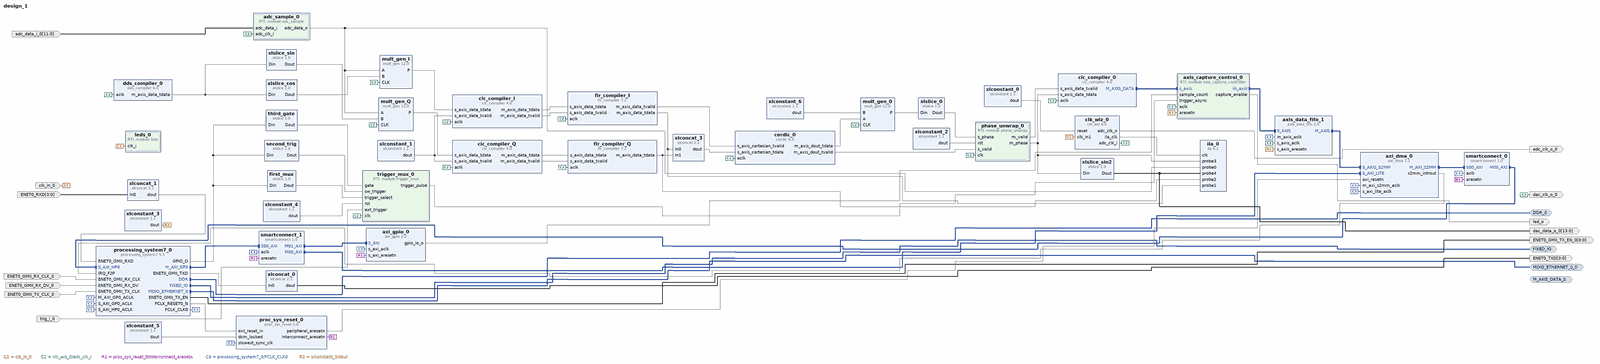
[diagram p0: block diagram of the top level, whole]
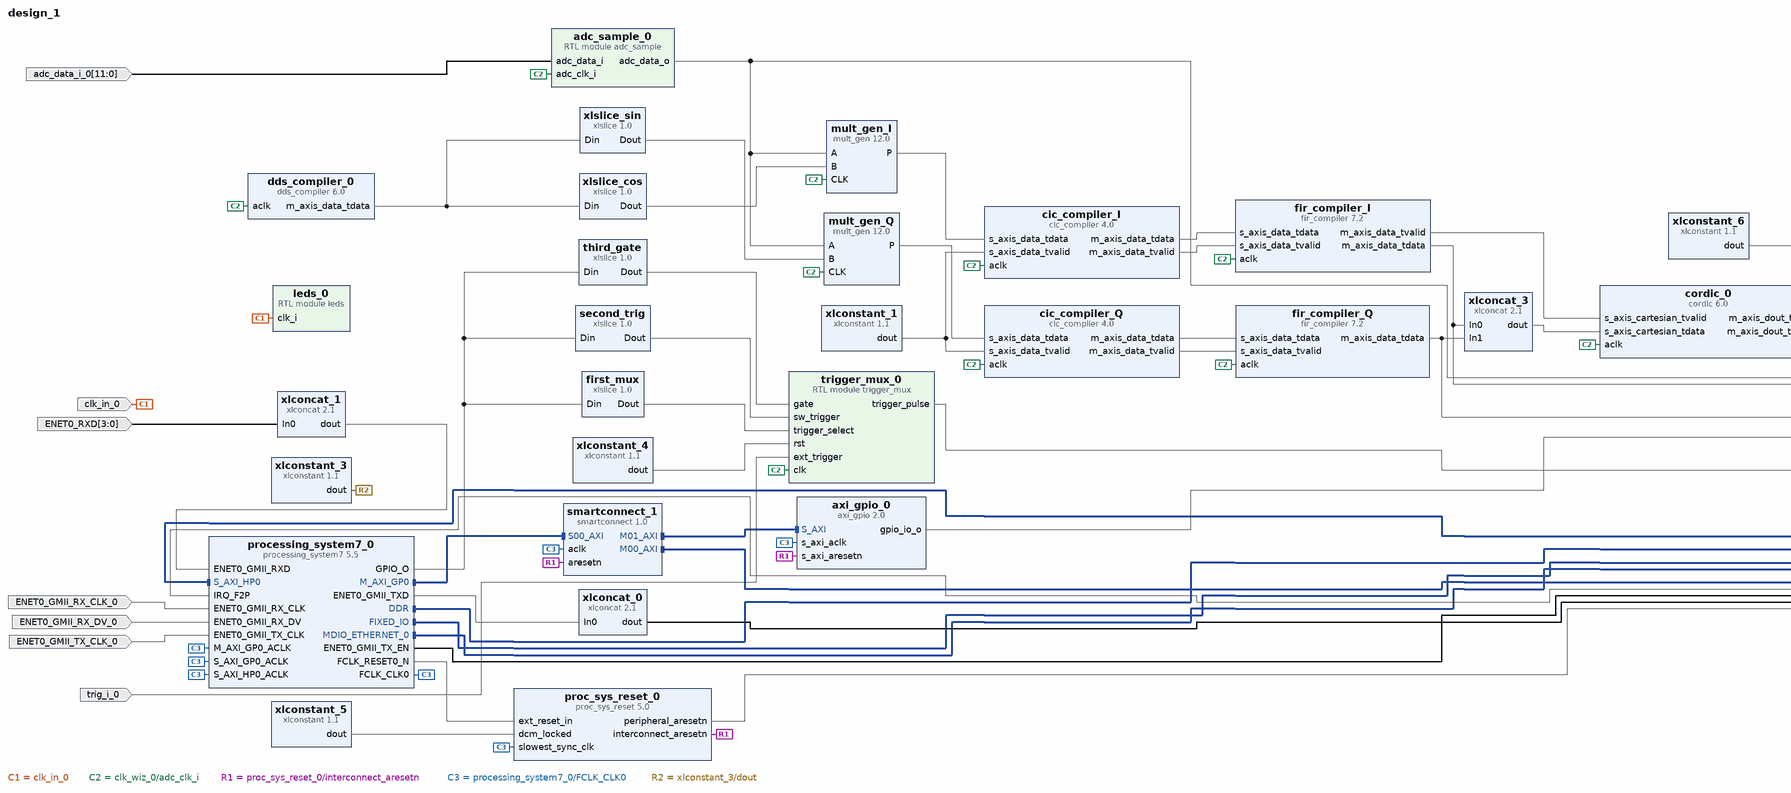
[diagram p1: block diagram of the top level, left part]
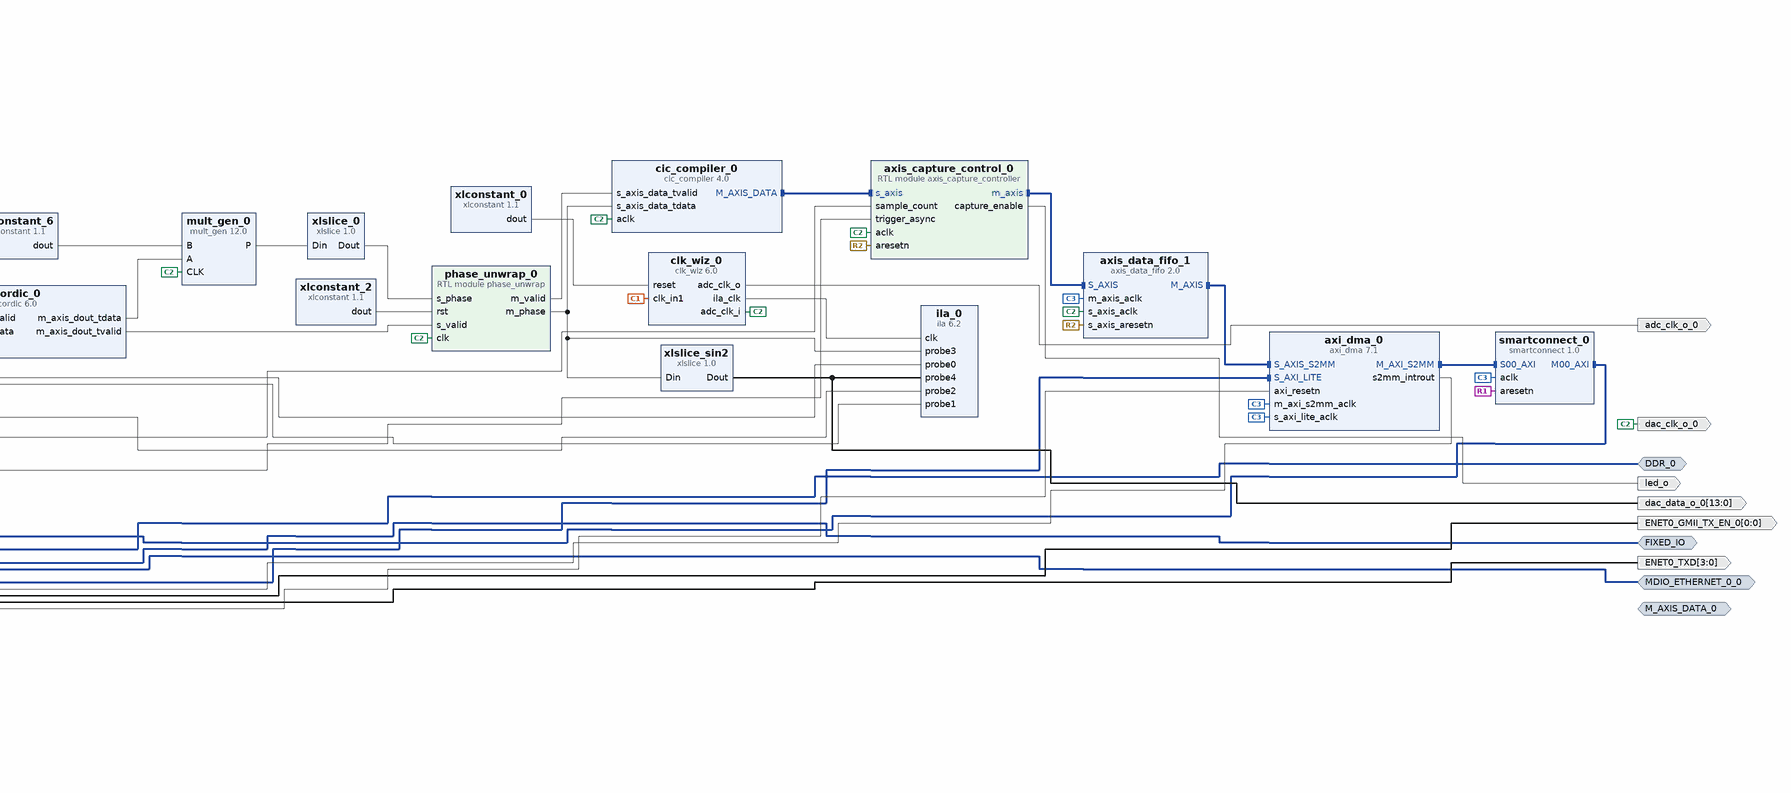
[diagram p2: block diagram of the top level, right part]
# Vivado block design design_1, xc7z010clg400-1, Vivado 2024.2
create_bd_design design_1

create_bd_intf_port -mode Master -vlnv xilinx.com:display_processing_system7:fixedio_rtl:1.0 FIXED_IO
create_bd_intf_port -mode Master -vlnv xilinx.com:interface:ddrx_rtl:1.0 DDR_0
create_bd_intf_port -mode Master -vlnv xilinx.com:interface:mdio_rtl:1.0 MDIO_ETHERNET_0_0
create_bd_intf_port -mode Master -vlnv xilinx.com:interface:axis_rtl:1.0 M_AXIS_DATA_0
set_property -dict {CONFIG.FREQ_HZ 50000000} [get_bd_intf_ports M_AXIS_DATA_0]
create_bd_port -dir O -from 3 -to 0 ENET0_TXD
create_bd_port -dir I -from 3 -to 0 ENET0_RXD
create_bd_port -dir I -type clk ENET0_GMII_RX_CLK_0
create_bd_port -dir I -type clk ENET0_GMII_TX_CLK_0
create_bd_port -dir I ENET0_GMII_RX_DV_0
create_bd_port -dir O -from 0 -to 0 ENET0_GMII_TX_EN_0
create_bd_port -dir O led_o
create_bd_port -dir I -from 11 -to 0 adc_data_i_0
create_bd_port -dir I clk_in_0
create_bd_port -dir O adc_clk_o_0
create_bd_port -dir O -type clk dac_clk_o_0
create_bd_port -dir O -from 13 -to 0 dac_data_o_0
create_bd_port -dir I trig_i_0

create_bd_cell -type ip -vlnv xilinx.com:ip:processing_system7:5.5 processing_system7_0
set_property -dict [list \
  CONFIG.PCW_ENET0_ENET0_IO EMIO \
  CONFIG.PCW_ENET0_GRP_MDIO_ENABLE 1 \
  CONFIG.PCW_ENET0_GRP_MDIO_IO EMIO \
  CONFIG.PCW_ENET0_PERIPHERAL_ENABLE 1 \
  CONFIG.PCW_ENET0_PERIPHERAL_FREQMHZ {100 Mbps} \
  CONFIG.PCW_ENET0_RESET_ENABLE 0 \
  CONFIG.PCW_ENET_RESET_ENABLE 1 \
  CONFIG.PCW_ENET_RESET_SELECT {Share reset pin} \
  CONFIG.PCW_FCLK_CLK0_BUF FALSE \
  CONFIG.PCW_FPGA0_PERIPHERAL_FREQMHZ 100 \
  CONFIG.PCW_FPGA1_PERIPHERAL_FREQMHZ 10 \
  CONFIG.PCW_GPIO_EMIO_GPIO_ENABLE 1 \
  CONFIG.PCW_GPIO_EMIO_GPIO_IO 4 \
  CONFIG.PCW_GPIO_EMIO_GPIO_WIDTH 4 \
  CONFIG.PCW_GPIO_MIO_GPIO_ENABLE 1 \
  CONFIG.PCW_GPIO_MIO_GPIO_IO MIO \
  CONFIG.PCW_I2C_RESET_ENABLE 1 \
  CONFIG.PCW_IRQ_F2P_INTR 1 \
  CONFIG.PCW_SD0_GRP_CD_ENABLE 1 \
  CONFIG.PCW_SD0_GRP_CD_IO {MIO 47} \
  CONFIG.PCW_SD0_GRP_WP_ENABLE 0 \
  CONFIG.PCW_SD0_PERIPHERAL_ENABLE 1 \
  CONFIG.PCW_SD0_SD0_IO {MIO 40 .. 45} \
  CONFIG.PCW_SDIO_PERIPHERAL_FREQMHZ 10 \
  CONFIG.PCW_S_AXI_HP0_DATA_WIDTH 32 \
  CONFIG.PCW_UART0_PERIPHERAL_ENABLE 1 \
  CONFIG.PCW_UART0_UART0_IO {MIO 14 .. 15} \
  CONFIG.PCW_UART1_PERIPHERAL_ENABLE 0 \
  CONFIG.PCW_UART_PERIPHERAL_FREQMHZ 100 \
  CONFIG.PCW_UIPARAM_DDR_BUS_WIDTH {16 Bit} \
  CONFIG.PCW_UIPARAM_DDR_FREQ_MHZ 533.333 \
  CONFIG.PCW_UIPARAM_DDR_PARTNO {MT41K256M16 RE-125} \
  CONFIG.PCW_USB0_PERIPHERAL_ENABLE 1 \
  CONFIG.PCW_USB0_RESET_ENABLE 0 \
  CONFIG.PCW_USB0_USB0_IO {MIO 28 .. 39} \
  CONFIG.PCW_USB_RESET_ENABLE 1 \
  CONFIG.PCW_USB_RESET_SELECT {Share reset pin} \
  CONFIG.PCW_USE_FABRIC_INTERRUPT 1 \
  CONFIG.PCW_USE_S_AXI_GP0 1 \
  CONFIG.PCW_USE_S_AXI_HP0 1 \
] [get_bd_cells processing_system7_0]
# 226 more settings of processing_system7_0 are not shown: defaults, MIO pin electricals, DDR timing, and values the tool derives
create_bd_cell -type ip -vlnv xilinx.com:ip:xlconcat:2.1 xlconcat_0
set_property -dict {CONFIG.IN0_WIDTH 4 CONFIG.NUM_PORTS 1 CONFIG.dout_width 4} [get_bd_cells xlconcat_0]
create_bd_cell -type ip -vlnv xilinx.com:ip:xlconcat:2.1 xlconcat_1
set_property -dict {CONFIG.IN0_WIDTH 4 CONFIG.IN1_WIDTH 4 CONFIG.dout_width 8} [get_bd_cells xlconcat_1]
create_bd_cell -type module -reference leds leds_0
create_bd_cell -type module -reference adc_sample adc_sample_0
create_bd_cell -type ip -vlnv xilinx.com:ip:ila:6.2 ila_0
set_property -dict [list \
  CONFIG.C_DATA_DEPTH 16384 \
  CONFIG.C_MONITOR_TYPE Native \
  CONFIG.C_NUM_OF_PROBES 5 \
  CONFIG.C_PROBE0_WIDTH 12 \
  CONFIG.C_PROBE10_WIDTH 1 \
  CONFIG.C_PROBE12_WIDTH 1 \
  CONFIG.C_PROBE1_WIDTH 24 \
  CONFIG.C_PROBE2_WIDTH 24 \
  CONFIG.C_PROBE3_WIDTH 32 \
  CONFIG.C_PROBE4_WIDTH 14 \
  CONFIG.C_PROBE5_WIDTH 1 \
  CONFIG.C_PROBE6_WIDTH 1 \
  CONFIG.C_PROBE7_WIDTH 1 \
  CONFIG.C_PROBE8_WIDTH 1 \
  CONFIG.C_PROBE9_WIDTH 1 \
  CONFIG.C_TRIGIN_EN false \
] [get_bd_cells ila_0]
create_bd_cell -type ip -vlnv xilinx.com:ip:clk_wiz:6.0 clk_wiz_0
set_property -dict [list \
  CONFIG.CLKIN1_JITTER_PS 1000.0 \
  CONFIG.CLKOUT1_JITTER 706.970 \
  CONFIG.CLKOUT1_PHASE_ERROR 883.386 \
  CONFIG.CLKOUT1_REQUESTED_OUT_FREQ 50 \
  CONFIG.CLKOUT2_JITTER 1045.072 \
  CONFIG.CLKOUT2_PHASE_ERROR 883.386 \
  CONFIG.CLKOUT2_REQUESTED_OUT_FREQ 5 \
  CONFIG.CLKOUT2_USED true \
  CONFIG.CLKOUT3_JITTER 710.474 \
  CONFIG.CLKOUT3_PHASE_ERROR 883.386 \
  CONFIG.CLKOUT3_REQUESTED_OUT_FREQ 50 \
  CONFIG.CLKOUT3_REQUESTED_PHASE 30 \
  CONFIG.CLKOUT3_USED true \
  CONFIG.CLKOUT4_JITTER 1045.072 \
  CONFIG.CLKOUT4_PHASE_ERROR 883.386 \
  CONFIG.CLKOUT4_REQUESTED_OUT_FREQ 5 \
  CONFIG.CLKOUT4_USED true \
  CONFIG.CLK_OUT1_PORT adc_clk_i \
  CONFIG.CLK_OUT2_PORT ila_clk \
  CONFIG.CLK_OUT3_PORT adc_clk_o \
  CONFIG.CLK_OUT4_PORT lo_o \
  CONFIG.MMCM_CLKFBOUT_MULT_F 62.500 \
  CONFIG.MMCM_CLKIN1_PERIOD 100.000 \
  CONFIG.MMCM_CLKIN2_PERIOD 10.0 \
  CONFIG.MMCM_CLKOUT0_DIVIDE_F 12.500 \
  CONFIG.MMCM_CLKOUT1_DIVIDE 125 \
  CONFIG.MMCM_CLKOUT2_DIVIDE 13 \
  CONFIG.MMCM_CLKOUT2_PHASE 31.154 \
  CONFIG.MMCM_CLKOUT3_DIVIDE 125 \
  CONFIG.NUM_OUT_CLKS 4 \
  CONFIG.PRIM_IN_FREQ 10 \
] [get_bd_cells clk_wiz_0]
create_bd_cell -type ip -vlnv xilinx.com:ip:xlconstant:1.1 xlconstant_0
set_property -dict {CONFIG.CONST_VAL 0} [get_bd_cells xlconstant_0]
create_bd_cell -type ip -vlnv xilinx.com:ip:dds_compiler:6.0 dds_compiler_0
set_property -dict [list \
  CONFIG.Channels 1 \
  CONFIG.DATA_Has_TLAST Not_Required \
  CONFIG.DDS_Clock_Rate 50 \
  CONFIG.DSP48_Use Minimal \
  CONFIG.Frequency_Resolution 0.4 \
  CONFIG.Latency 7 \
  CONFIG.M_DATA_Has_TUSER Not_Required \
  CONFIG.M_PHASE_Has_TUSER Not_Required \
  CONFIG.Noise_Shaping None \
  CONFIG.OUTPUT_FORM Twos_Complement \
  CONFIG.Output_Frequency1 0 \
  CONFIG.Output_Width 12 \
  CONFIG.PINC1 000110011001100110011001100110011001100110011010 \
  CONFIG.Parameter_Entry Hardware_Parameters \
  CONFIG.Phase_Increment Fixed \
  CONFIG.Phase_Width 48 \
  CONFIG.S_PHASE_Has_TUSER Not_Required \
] [get_bd_cells dds_compiler_0]
create_bd_cell -type ip -vlnv xilinx.com:ip:xlslice:1.0 xlslice_cos
set_property -dict {CONFIG.DIN_FROM 27 CONFIG.DIN_TO 16 CONFIG.DIN_WIDTH 32} [get_bd_cells xlslice_cos]
create_bd_cell -type ip -vlnv xilinx.com:ip:xlslice:1.0 xlslice_sin
set_property -dict {CONFIG.DIN_FROM 11 CONFIG.DIN_TO 0 CONFIG.DIN_WIDTH 32 CONFIG.DOUT_WIDTH 12} [get_bd_cells xlslice_sin]
create_bd_cell -type ip -vlnv xilinx.com:ip:mult_gen:12.0 mult_gen_I
set_property -dict [list \
  CONFIG.MultType Parallel_Multiplier \
  CONFIG.Multiplier_Construction Use_Mults \
  CONFIG.PortAType Signed \
  CONFIG.PortAWidth 12 \
  CONFIG.PortBType Signed \
  CONFIG.PortBWidth 12 \
] [get_bd_cells mult_gen_I]
create_bd_cell -type ip -vlnv xilinx.com:ip:mult_gen:12.0 mult_gen_Q
set_property -dict [list \
  CONFIG.MultType Parallel_Multiplier \
  CONFIG.Multiplier_Construction Use_Mults \
  CONFIG.PortAType Signed \
  CONFIG.PortAWidth 12 \
  CONFIG.PortBType Signed \
  CONFIG.PortBWidth 12 \
] [get_bd_cells mult_gen_Q]
create_bd_cell -type ip -vlnv xilinx.com:ip:fir_compiler:7.2 fir_compiler_I
set_property -dict [list \
  CONFIG.Clock_Frequency 50 \
  CONFIG.CoefficientVector 0,0,0,1,1,2,2,3,4,6,7,9,11,13,15,18,20,24,27,31,35,39,44,49,54,59,65,72,78,85,92,100,108,116,124,132,141,150,159,168,177,186,195,204,213,221,230,238,246,254,262,269,275,281,287,292,297,301,305,307,310,311,312,313,312,311,310,307,305,301,297,292,287,281,275,269,262,254,246,238,230,221,213,204,195,186,177,168,159,150,141,132,124,116,108,100,92,85,78,72,65,59,54,49,44,39,35,31,27,24,20,18,15,13,11,9,7,6,4,3,2,2,1,1,0,0,0 \
  CONFIG.Coefficient_Fanout true \
  CONFIG.Coefficient_Fractional_Bits 0 \
  CONFIG.Coefficient_Sets 1 \
  CONFIG.Coefficient_Sign Unsigned \
  CONFIG.Coefficient_Structure Inferred \
  CONFIG.Coefficient_Width 18 \
  CONFIG.ColumnConfig 7 \
  CONFIG.Control_Broadcast_Fanout true \
  CONFIG.Control_Column_Fanout true \
  CONFIG.Control_LUT_Pipeline true \
  CONFIG.Control_Path_Fanout true \
  CONFIG.Data_Path_Broadcast false \
  CONFIG.Data_Path_Fanout true \
  CONFIG.Data_Sign Signed \
  CONFIG.Data_Width 24 \
  CONFIG.Decimation_Rate 1 \
  CONFIG.Disable_Half_Band_Centre_Tap false \
  CONFIG.Filter_Architecture Systolic_Multiply_Accumulate \
  CONFIG.Filter_Type Single_Rate \
  CONFIG.Interpolation_Rate 1 \
  CONFIG.No_BRAM_Read_First_Mode true \
  CONFIG.No_SRL_Attributes false \
  CONFIG.Number_Channels 1 \
  CONFIG.Optimal_Column_Lengths true \
  CONFIG.Optimization_Goal Speed \
  CONFIG.Optimization_List Data_Path_Fanout,Pre-Adder_Pipeline,Coefficient_Fanout,Control_Path_Fanout,Control_Column_Fanout,Control_Broadcast_Fanout,Control_LUT_Pipeline,No_BRAM_Read_First_Mode,Optimal_Column_Lengths,Other \
  CONFIG.Optimization_Selection All \
  CONFIG.Other true \
  CONFIG.Output_Rounding_Mode Convergent_Rounding_to_Even \
  CONFIG.Output_Width 24 \
  CONFIG.Pre_Adder_Pipeline true \
  CONFIG.Quantization Integer_Coefficients \
  CONFIG.RateSpecification Frequency_Specification \
  CONFIG.Sample_Frequency 5 \
  CONFIG.Zero_Pack_Factor 1 \
] [get_bd_cells fir_compiler_I]
create_bd_cell -type ip -vlnv xilinx.com:ip:cic_compiler:4.0 cic_compiler_I
set_property -dict [list \
  CONFIG.Clock_Frequency 50 \
  CONFIG.Filter_Type Decimation \
  CONFIG.Fixed_Or_Initial_Rate 10 \
  CONFIG.Input_Data_Width 24 \
  CONFIG.Input_Sample_Frequency 50 \
  CONFIG.Maximum_Rate 10 \
  CONFIG.Minimum_Rate 10 \
  CONFIG.Number_Of_Channels 1 \
  CONFIG.Number_Of_Stages 4 \
  CONFIG.Output_Data_Width 24 \
  CONFIG.Quantization Truncation \
  CONFIG.SamplePeriod 1 \
] [get_bd_cells cic_compiler_I]
create_bd_cell -type ip -vlnv xilinx.com:ip:cic_compiler:4.0 cic_compiler_Q
set_property -dict [list \
  CONFIG.Clock_Frequency 50 \
  CONFIG.Filter_Type Decimation \
  CONFIG.Fixed_Or_Initial_Rate 10 \
  CONFIG.Input_Data_Width 24 \
  CONFIG.Input_Sample_Frequency 50 \
  CONFIG.Maximum_Rate 10 \
  CONFIG.Minimum_Rate 10 \
  CONFIG.Number_Of_Channels 1 \
  CONFIG.Number_Of_Stages 4 \
  CONFIG.Output_Data_Width 24 \
  CONFIG.Quantization Truncation \
  CONFIG.SamplePeriod 1 \
] [get_bd_cells cic_compiler_Q]
create_bd_cell -type ip -vlnv xilinx.com:ip:xlconstant:1.1 xlconstant_1
create_bd_cell -type ip -vlnv xilinx.com:ip:fir_compiler:7.2 fir_compiler_Q
set_property -dict [list \
  CONFIG.Clock_Frequency 50 \
  CONFIG.CoefficientVector 0,0,0,1,1,2,2,3,4,6,7,9,11,13,15,18,20,24,27,31,35,39,44,49,54,59,65,72,78,85,92,100,108,116,124,132,141,150,159,168,177,186,195,204,213,221,230,238,246,254,262,269,275,281,287,292,297,301,305,307,310,311,312,313,312,311,310,307,305,301,297,292,287,281,275,269,262,254,246,238,230,221,213,204,195,186,177,168,159,150,141,132,124,116,108,100,92,85,78,72,65,59,54,49,44,39,35,31,27,24,20,18,15,13,11,9,7,6,4,3,2,2,1,1,0,0,0 \
  CONFIG.Coefficient_Fanout true \
  CONFIG.Coefficient_Fractional_Bits 0 \
  CONFIG.Coefficient_Sets 1 \
  CONFIG.Coefficient_Sign Unsigned \
  CONFIG.Coefficient_Structure Inferred \
  CONFIG.Coefficient_Width 18 \
  CONFIG.ColumnConfig 7 \
  CONFIG.Control_Broadcast_Fanout true \
  CONFIG.Control_Column_Fanout true \
  CONFIG.Control_LUT_Pipeline true \
  CONFIG.Control_Path_Fanout true \
  CONFIG.Data_Path_Broadcast false \
  CONFIG.Data_Path_Fanout true \
  CONFIG.Data_Sign Signed \
  CONFIG.Data_Width 24 \
  CONFIG.Decimation_Rate 1 \
  CONFIG.Disable_Half_Band_Centre_Tap false \
  CONFIG.Filter_Architecture Systolic_Multiply_Accumulate \
  CONFIG.Filter_Type Single_Rate \
  CONFIG.Interpolation_Rate 1 \
  CONFIG.No_BRAM_Read_First_Mode true \
  CONFIG.No_SRL_Attributes false \
  CONFIG.Number_Channels 1 \
  CONFIG.Optimal_Column_Lengths true \
  CONFIG.Optimization_Goal Speed \
  CONFIG.Optimization_List Data_Path_Fanout,Pre-Adder_Pipeline,Coefficient_Fanout,Control_Path_Fanout,Control_Column_Fanout,Control_Broadcast_Fanout,Control_LUT_Pipeline,No_BRAM_Read_First_Mode,Optimal_Column_Lengths,Other \
  CONFIG.Optimization_Selection All \
  CONFIG.Other true \
  CONFIG.Output_Rounding_Mode Convergent_Rounding_to_Even \
  CONFIG.Output_Width 24 \
  CONFIG.Pre_Adder_Pipeline true \
  CONFIG.Quantization Integer_Coefficients \
  CONFIG.RateSpecification Frequency_Specification \
  CONFIG.Sample_Frequency 5 \
  CONFIG.Zero_Pack_Factor 1 \
] [get_bd_cells fir_compiler_Q]
create_bd_cell -type ip -vlnv xilinx.com:ip:cordic:6.0 cordic_0
set_property -dict [list \
  CONFIG.Compensation_Scaling No_Scale_Compensation \
  CONFIG.Data_Format SignedFraction \
  CONFIG.Functional_Selection Arc_Tan \
  CONFIG.Input_Width 24 \
  CONFIG.Iterations 24 \
  CONFIG.Output_Width 24 \
  CONFIG.Phase_Format Radians \
  CONFIG.Precision 26 \
  CONFIG.Round_Mode Nearest_Even \
] [get_bd_cells cordic_0]
create_bd_cell -type ip -vlnv xilinx.com:ip:xlconcat:2.1 xlconcat_3
set_property -dict {CONFIG.IN0_WIDTH 24 CONFIG.IN1_WIDTH 24 CONFIG.IN2_WIDTH 8 CONFIG.NUM_PORTS 2} [get_bd_cells xlconcat_3]
create_bd_cell -type module -reference phase_unwrap phase_unwrap_0
create_bd_cell -type ip -vlnv xilinx.com:ip:xlconstant:1.1 xlconstant_2
set_property -dict {CONFIG.CONST_VAL 0} [get_bd_cells xlconstant_2]
create_bd_cell -type ip -vlnv xilinx.com:ip:xlslice:1.0 xlslice_sin2
set_property -dict {CONFIG.DIN_FROM 23 CONFIG.DIN_TO 10 CONFIG.DIN_WIDTH 32 CONFIG.DOUT_WIDTH 14} [get_bd_cells xlslice_sin2]
create_bd_cell -type ip -vlnv xilinx.com:ip:axi_dma:7.1 axi_dma_0
set_property -dict [list \
  CONFIG.c_include_mm2s 0 \
  CONFIG.c_include_sg 0 \
  CONFIG.c_m_axi_s2mm_data_width 64 \
  CONFIG.c_sg_length_width 26 \
] [get_bd_cells axi_dma_0]
create_bd_cell -type ip -vlnv xilinx.com:ip:cic_compiler:4.0 cic_compiler_0
set_property -dict [list \
  CONFIG.Clock_Frequency 50 \
  CONFIG.Filter_Type Decimation \
  CONFIG.Fixed_Or_Initial_Rate 10 \
  CONFIG.HAS_DOUT_TREADY true \
  CONFIG.Input_Data_Width 32 \
  CONFIG.Input_Sample_Frequency 5 \
  CONFIG.Maximum_Rate 10 \
  CONFIG.Minimum_Rate 10 \
  CONFIG.Output_Data_Width 32 \
  CONFIG.Quantization Truncation \
  CONFIG.SamplePeriod 1 \
] [get_bd_cells cic_compiler_0]
create_bd_cell -type module -reference axis_capture_controller axis_capture_control_0
create_bd_cell -type module -reference trigger_mux trigger_mux_0
create_bd_cell -type ip -vlnv xilinx.com:ip:xlslice:1.0 first_mux
set_property -dict {CONFIG.DIN_FROM 0 CONFIG.DIN_WIDTH 4} [get_bd_cells first_mux]
create_bd_cell -type ip -vlnv xilinx.com:ip:xlslice:1.0 second_trig
set_property -dict {CONFIG.DIN_FROM 1 CONFIG.DIN_TO 1 CONFIG.DIN_WIDTH 4} [get_bd_cells second_trig]
create_bd_cell -type ip -vlnv xilinx.com:ip:xlconstant:1.1 xlconstant_4
set_property -dict {CONFIG.CONST_VAL 0} [get_bd_cells xlconstant_4]
create_bd_cell -type ip -vlnv xilinx.com:ip:proc_sys_reset:5.0 proc_sys_reset_0
create_bd_cell -type ip -vlnv xilinx.com:ip:xlconstant:1.1 xlconstant_5
create_bd_cell -type ip -vlnv xilinx.com:ip:smartconnect:1.0 smartconnect_0
set_property -dict {CONFIG.NUM_SI 1} [get_bd_cells smartconnect_0]
create_bd_cell -type ip -vlnv xilinx.com:ip:smartconnect:1.0 smartconnect_1
set_property -dict {CONFIG.NUM_MI 2 CONFIG.NUM_SI 1} [get_bd_cells smartconnect_1]
create_bd_cell -type ip -vlnv xilinx.com:ip:xlconstant:1.1 xlconstant_3
create_bd_cell -type ip -vlnv xilinx.com:ip:mult_gen:12.0 mult_gen_0
set_property -dict [list \
  CONFIG.PipeStages 4 \
  CONFIG.PortAType Signed \
  CONFIG.PortAWidth 24 \
  CONFIG.PortBType Unsigned \
  CONFIG.PortBWidth 21 \
] [get_bd_cells mult_gen_0]
create_bd_cell -type ip -vlnv xilinx.com:ip:xlconstant:1.1 xlconstant_6
set_property -dict {CONFIG.CONST_VAL 1335067 CONFIG.CONST_WIDTH 21} [get_bd_cells xlconstant_6]
create_bd_cell -type ip -vlnv xilinx.com:ip:xlslice:1.0 xlslice_0
set_property -dict {CONFIG.DIN_FROM 43 CONFIG.DIN_TO 20 CONFIG.DIN_WIDTH 45} [get_bd_cells xlslice_0]
create_bd_cell -type ip -vlnv xilinx.com:ip:axis_data_fifo:2.0 axis_data_fifo_1
set_property -dict [list \
  CONFIG.FIFO_DEPTH 4096 \
  CONFIG.HAS_TKEEP 1 \
  CONFIG.HAS_TLAST 1 \
  CONFIG.IS_ACLK_ASYNC 1 \
  CONFIG.TDATA_NUM_BYTES 4 \
] [get_bd_cells axis_data_fifo_1]
create_bd_cell -type ip -vlnv xilinx.com:ip:xlslice:1.0 third_gate
set_property -dict {CONFIG.DIN_FROM 2 CONFIG.DIN_TO 2 CONFIG.DIN_WIDTH 4} [get_bd_cells third_gate]
create_bd_cell -type ip -vlnv xilinx.com:ip:axi_gpio:2.0 axi_gpio_0
set_property -dict {CONFIG.C_ALL_OUTPUTS 1 CONFIG.C_DOUT_DEFAULT 0x0007A120} [get_bd_cells axi_gpio_0]

# ---- connections ----

connect_bd_intf_net [get_bd_intf_pins axi_dma_0/M_AXI_S2MM] [get_bd_intf_pins smartconnect_0/S00_AXI]
connect_bd_intf_net [get_bd_intf_pins axis_capture_control_0/m_axis] [get_bd_intf_pins axis_data_fifo_1/S_AXIS]
connect_bd_intf_net [get_bd_intf_pins axis_data_fifo_1/M_AXIS] [get_bd_intf_pins axi_dma_0/S_AXIS_S2MM]
connect_bd_intf_net [get_bd_intf_pins cic_compiler_0/M_AXIS_DATA] [get_bd_intf_pins axis_capture_control_0/s_axis]
connect_bd_intf_net [get_bd_intf_ports DDR_0] [get_bd_intf_pins processing_system7_0/DDR]
connect_bd_intf_net [get_bd_intf_ports FIXED_IO] [get_bd_intf_pins processing_system7_0/FIXED_IO]
connect_bd_intf_net [get_bd_intf_ports MDIO_ETHERNET_0_0] [get_bd_intf_pins processing_system7_0/MDIO_ETHERNET_0]
connect_bd_intf_net [get_bd_intf_pins processing_system7_0/M_AXI_GP0] [get_bd_intf_pins smartconnect_1/S00_AXI]
connect_bd_intf_net [get_bd_intf_pins processing_system7_0/S_AXI_HP0] [get_bd_intf_pins smartconnect_0/M00_AXI]
connect_bd_intf_net [get_bd_intf_pins smartconnect_1/M00_AXI] [get_bd_intf_pins axi_dma_0/S_AXI_LITE]
connect_bd_intf_net [get_bd_intf_pins smartconnect_1/M01_AXI] [get_bd_intf_pins axi_gpio_0/S_AXI]
connect_bd_net -net ENET0_GMII_RX_CLK_0_1 [get_bd_ports ENET0_GMII_RX_CLK_0] [get_bd_pins processing_system7_0/ENET0_GMII_RX_CLK]
connect_bd_net -net ENET0_GMII_RX_DV_0_1 [get_bd_ports ENET0_GMII_RX_DV_0] [get_bd_pins processing_system7_0/ENET0_GMII_RX_DV]
connect_bd_net -net ENET0_GMII_TX_CLK_0_1 [get_bd_ports ENET0_GMII_TX_CLK_0] [get_bd_pins processing_system7_0/ENET0_GMII_TX_CLK]
connect_bd_net -net In0_0_1 [get_bd_ports ENET0_RXD] [get_bd_pins xlconcat_1/In0]
connect_bd_net -net adc_data_i_0_1 [get_bd_ports adc_data_i_0] [get_bd_pins adc_sample_0/adc_data_i]
connect_bd_net [get_bd_pins adc_sample_0/adc_data_o] [get_bd_pins ila_0/probe0] [get_bd_pins mult_gen_I/A] [get_bd_pins mult_gen_Q/A]
connect_bd_net [get_bd_pins axi_dma_0/s2mm_introut] [get_bd_pins processing_system7_0/IRQ_F2P]
connect_bd_net [get_bd_pins axi_gpio_0/gpio_io_o] [get_bd_pins axis_capture_control_0/sample_count]
connect_bd_net [get_bd_pins axis_capture_control_0/capture_enable] [get_bd_ports led_o]
connect_bd_net -net cic_compiler_0_m_axis_data_tdata [get_bd_pins cic_compiler_I/m_axis_data_tdata] [get_bd_pins fir_compiler_I/s_axis_data_tdata]
connect_bd_net -net cic_compiler_0_m_axis_data_tvalid [get_bd_pins cic_compiler_I/m_axis_data_tvalid] [get_bd_pins fir_compiler_I/s_axis_data_tvalid]
connect_bd_net -net cic_compiler_1_m_axis_data_tdata [get_bd_pins cic_compiler_Q/m_axis_data_tdata] [get_bd_pins fir_compiler_Q/s_axis_data_tdata]
connect_bd_net -net cic_compiler_1_m_axis_data_tvalid [get_bd_pins cic_compiler_Q/m_axis_data_tvalid] [get_bd_pins fir_compiler_Q/s_axis_data_tvalid]
connect_bd_net -net clk_in_0_1 [get_bd_ports clk_in_0] [get_bd_pins clk_wiz_0/clk_in1] [get_bd_pins leds_0/clk_i]
connect_bd_net [get_bd_pins clk_wiz_0/adc_clk_i] \
  [get_bd_pins dds_compiler_0/aclk] [get_bd_pins mult_gen_I/CLK] [get_bd_pins mult_gen_Q/CLK] \
  [get_bd_pins fir_compiler_I/aclk] [get_bd_pins cic_compiler_I/aclk] [get_bd_pins cic_compiler_Q/aclk] \
  [get_bd_pins fir_compiler_Q/aclk] [get_bd_pins cordic_0/aclk] [get_bd_ports dac_clk_o_0] [get_bd_pins cic_compiler_0/aclk] \
  [get_bd_pins mult_gen_0/CLK] [get_bd_pins axis_data_fifo_1/s_axis_aclk] [get_bd_pins adc_sample_0/adc_clk_i] \
  [get_bd_pins phase_unwrap_0/clk] [get_bd_pins trigger_mux_0/clk] [get_bd_pins axis_capture_control_0/aclk]
connect_bd_net [get_bd_pins clk_wiz_0/adc_clk_o] [get_bd_ports adc_clk_o_0]
connect_bd_net [get_bd_pins clk_wiz_0/ila_clk] [get_bd_pins ila_0/clk]
connect_bd_net [get_bd_pins cordic_0/m_axis_dout_tvalid] [get_bd_pins phase_unwrap_0/s_valid]
connect_bd_net [get_bd_pins dds_compiler_0/m_axis_data_tdata] [get_bd_pins xlslice_cos/Din] [get_bd_pins xlslice_sin/Din]
connect_bd_net [get_bd_pins fir_compiler_I/m_axis_data_tvalid] [get_bd_pins cordic_0/s_axis_cartesian_tvalid]
connect_bd_net [get_bd_pins first_mux/Dout] [get_bd_pins trigger_mux_0/trigger_select]
connect_bd_net [get_bd_pins mult_gen_0/P] [get_bd_pins xlslice_0/Din]
connect_bd_net [get_bd_pins mult_gen_I/P] [get_bd_pins cic_compiler_I/s_axis_data_tdata]
connect_bd_net [get_bd_pins mult_gen_Q/P] [get_bd_pins cic_compiler_Q/s_axis_data_tdata]
connect_bd_net [get_bd_pins phase_unwrap_0/m_phase] \
  [get_bd_pins xlslice_sin2/Din] [get_bd_pins cic_compiler_0/s_axis_data_tdata] [get_bd_pins ila_0/probe3]
connect_bd_net [get_bd_pins phase_unwrap_0/m_valid] [get_bd_pins cic_compiler_0/s_axis_data_tvalid]
connect_bd_net [get_bd_pins proc_sys_reset_0/interconnect_aresetn] \
  [get_bd_pins smartconnect_1/aresetn] [get_bd_pins smartconnect_0/aresetn] [get_bd_pins axi_gpio_0/s_axi_aresetn]
connect_bd_net [get_bd_pins processing_system7_0/ENET0_GMII_TXD] [get_bd_pins xlconcat_0/In0]
connect_bd_net [get_bd_pins processing_system7_0/ENET0_GMII_TX_EN] [get_bd_ports ENET0_GMII_TX_EN_0]
connect_bd_net [get_bd_pins processing_system7_0/FCLK_CLK0] \
  [get_bd_pins processing_system7_0/M_AXI_GP0_ACLK] [get_bd_pins axi_dma_0/s_axi_lite_aclk] \
  [get_bd_pins axi_dma_0/m_axi_s2mm_aclk] [get_bd_pins proc_sys_reset_0/slowest_sync_clk] \
  [get_bd_pins processing_system7_0/S_AXI_HP0_ACLK] [get_bd_pins processing_system7_0/S_AXI_GP0_ACLK] \
  [get_bd_pins smartconnect_1/aclk] [get_bd_pins smartconnect_0/aclk] [get_bd_pins axis_data_fifo_1/m_axis_aclk] \
  [get_bd_pins axi_gpio_0/s_axi_aclk]
connect_bd_net [get_bd_pins processing_system7_0/FCLK_RESET0_N] [get_bd_pins proc_sys_reset_0/ext_reset_in]
connect_bd_net [get_bd_pins processing_system7_0/GPIO_O] [get_bd_pins first_mux/Din] [get_bd_pins second_trig/Din] [get_bd_pins third_gate/Din]
connect_bd_net [get_bd_pins second_trig/Dout] [get_bd_pins trigger_mux_0/sw_trigger]
connect_bd_net [get_bd_pins third_gate/Dout] [get_bd_pins trigger_mux_0/gate]
connect_bd_net -net trig_i_0_1 [get_bd_ports trig_i_0] [get_bd_pins trigger_mux_0/ext_trigger]
connect_bd_net [get_bd_pins trigger_mux_0/trigger_pulse] [get_bd_pins axis_capture_control_0/trigger_async]
connect_bd_net -net util_vector_logic_0_Res [get_bd_pins xlslice_sin2/Dout] [get_bd_ports dac_data_o_0] [get_bd_pins ila_0/probe4]
connect_bd_net [get_bd_pins xlconcat_0/dout] [get_bd_ports ENET0_TXD]
connect_bd_net [get_bd_pins xlconcat_1/dout] [get_bd_pins processing_system7_0/ENET0_GMII_RXD]
connect_bd_net [get_bd_pins xlconcat_3/dout] [get_bd_pins cordic_0/s_axis_cartesian_tdata]
connect_bd_net [get_bd_pins xlconstant_0/dout] [get_bd_pins clk_wiz_0/reset]
connect_bd_net [get_bd_pins xlconstant_1/dout] [get_bd_pins cic_compiler_Q/s_axis_data_tvalid] [get_bd_pins cic_compiler_I/s_axis_data_tvalid]
connect_bd_net [get_bd_pins xlconstant_2/dout] [get_bd_pins phase_unwrap_0/rst]
connect_bd_net -net xlconstant_3_dout [get_bd_pins proc_sys_reset_0/peripheral_aresetn] [get_bd_pins axi_dma_0/axi_resetn]
connect_bd_net [get_bd_pins xlconstant_3/dout] [get_bd_pins axis_data_fifo_1/s_axis_aresetn] [get_bd_pins axis_capture_control_0/aresetn]
connect_bd_net [get_bd_pins xlconstant_4/dout] [get_bd_pins trigger_mux_0/rst]
connect_bd_net [get_bd_pins xlconstant_5/dout] [get_bd_pins proc_sys_reset_0/dcm_locked]
connect_bd_net [get_bd_pins xlconstant_6/dout] [get_bd_pins mult_gen_0/B]
connect_bd_net -net xlslice_0_Dout [get_bd_pins xlslice_cos/Dout] [get_bd_pins mult_gen_I/B]
connect_bd_net -net xlslice_0_Dout1 [get_bd_pins cordic_0/m_axis_dout_tdata] [get_bd_pins mult_gen_0/A]
connect_bd_net [get_bd_pins xlslice_0/Dout] [get_bd_pins phase_unwrap_0/s_phase]
connect_bd_net -net xlslice_1_Dout [get_bd_pins xlslice_sin/Dout] [get_bd_pins mult_gen_Q/B]
connect_bd_net -net xlslice_cos1_Dout [get_bd_pins fir_compiler_Q/m_axis_data_tdata] [get_bd_pins ila_0/probe2] [get_bd_pins xlconcat_3/In1]
connect_bd_net -net xlslice_cos2_Dout [get_bd_pins fir_compiler_I/m_axis_data_tdata] [get_bd_pins ila_0/probe1] [get_bd_pins xlconcat_3/In0]

# ---- address map ----
assign_bd_address -offset 0x00000000 -range 512M -target_address_space [get_bd_addr_spaces axi_dma_0/Data_S2MM] [get_bd_addr_segs processing_system7_0/S_AXI_HP0/HP0_DDR_LOWOCM]
assign_bd_address -offset 0x40400000 -range 64K -target_address_space [get_bd_addr_spaces processing_system7_0/Data] [get_bd_addr_segs axi_dma_0/S_AXI_LITE/Reg]
assign_bd_address -offset 0x41200000 -range 64K -target_address_space [get_bd_addr_spaces processing_system7_0/Data] [get_bd_addr_segs axi_gpio_0/S_AXI/Reg]

validate_bd_design
save_bd_design
